# EAGLE design EVmulator_T85_Proto (EAGLE 9.6.2)
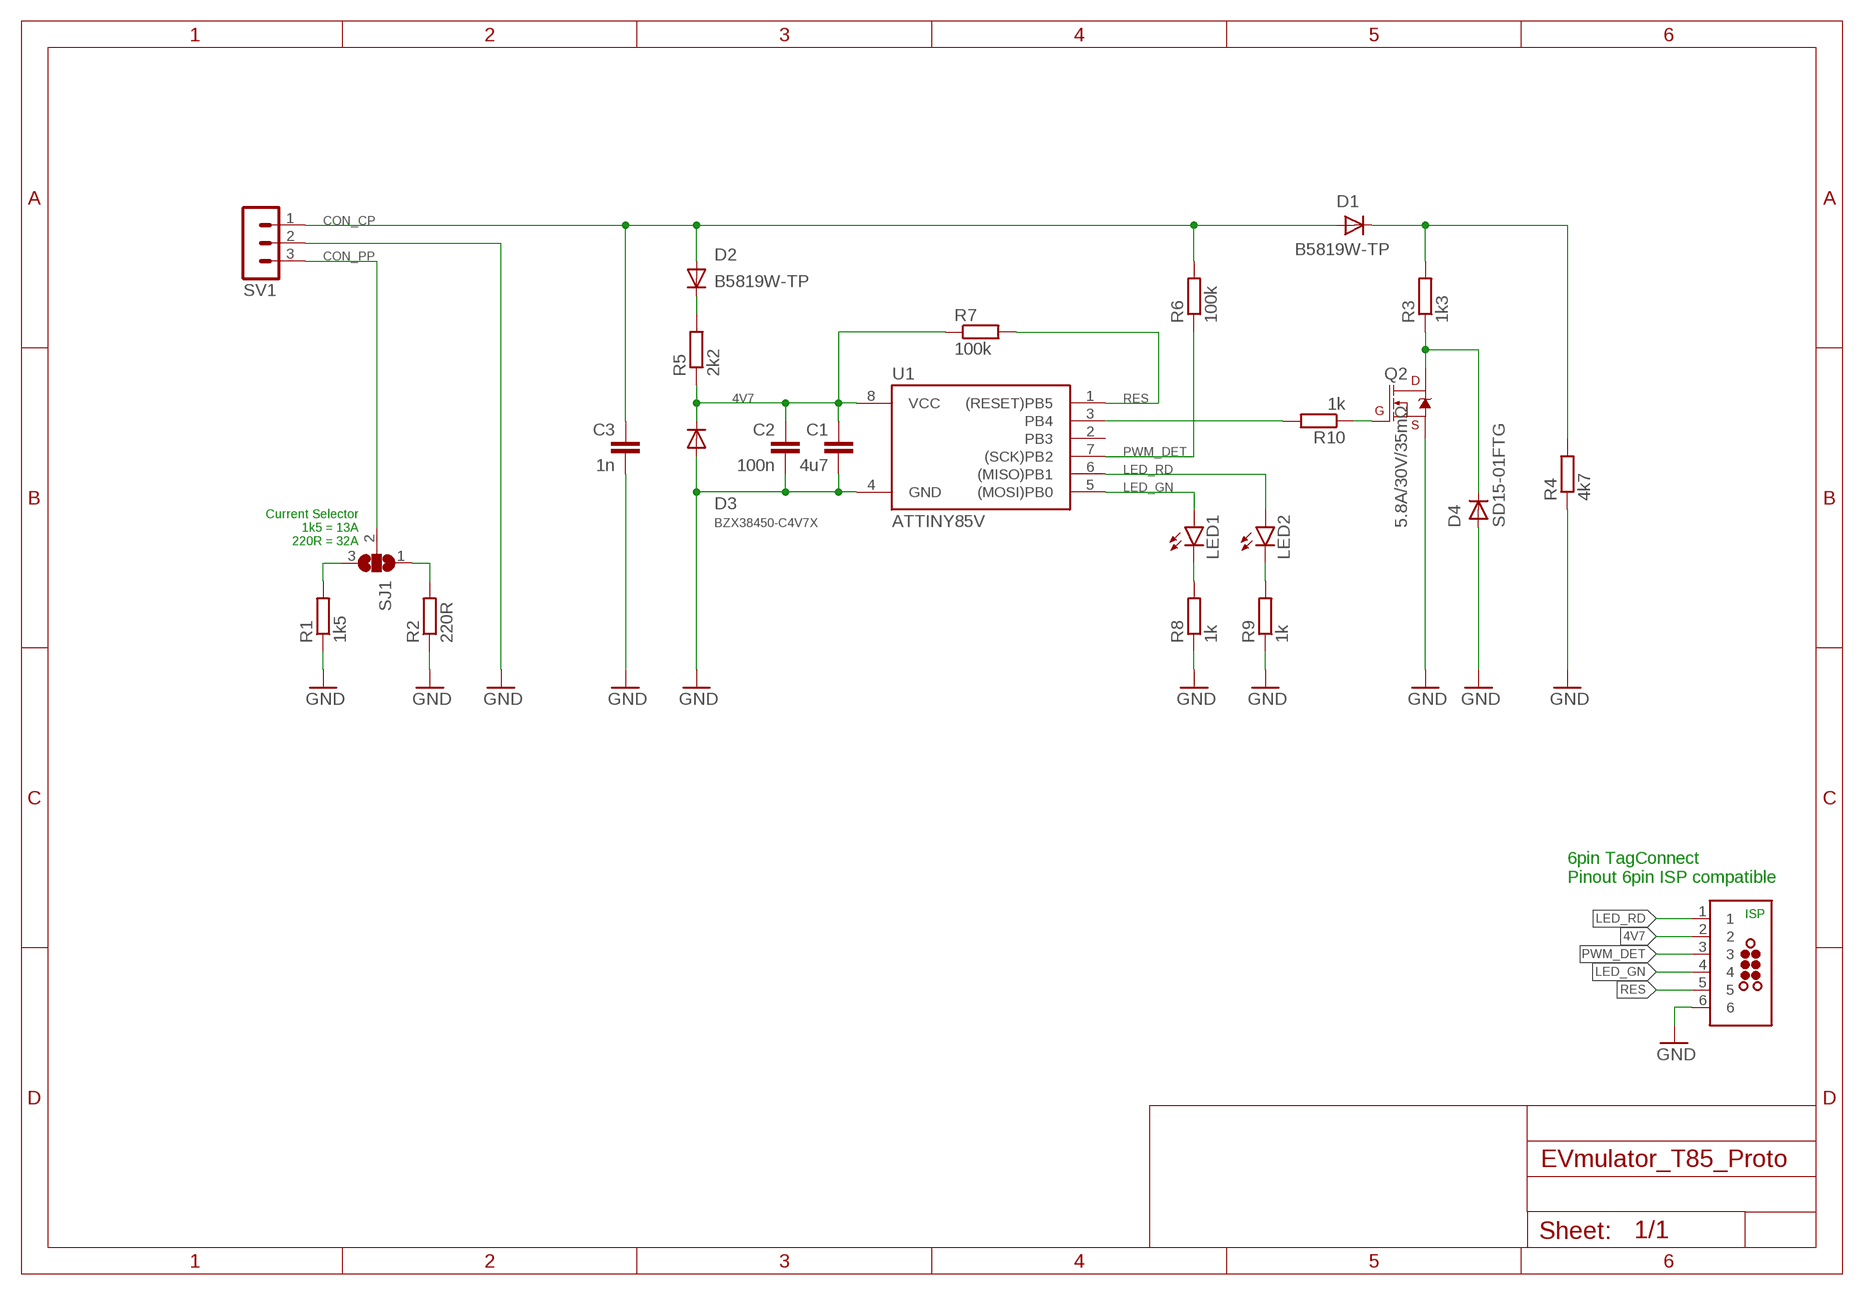
[diagram p0: schematic, sheet 1]

## Parts
C1  4u7  C-EUC0603  [C0603]
C2  100n  C-EUC0603  [C0603]
C3  1n  C-EUC0603  [C0603]
D1  B5819W-TP  DIODESOD-123  [SOD-123]
D2  B5819W-TP  DIODESOD-123  [SOD-123]
D3  BZX38450-C4V7X  DIODESOD-323F  [SOD-323F]
D4  SD15-01FTG  DIODESOD-323F  [SOD-323F]
J1  TAG-CONNECT_TC2030-MCP-NL  [TAG-CONNECT_TC2030-MCP-NL]
LED1  LEDCHIP-LED0603  [CHIP-LED0603]
LED2  LEDCHIP-LED0603  [CHIP-LED0603]
Q2  5.8A/30V/35mΩ  MOSFET-NCH-AO3404A  [SOT23-3]
R1  1k5  R-EU_R0805  [R0805]
R2  220R  R-EU_R0805  [R0805]
R3  1k3  R-EU_R0603  [R0603]
R4  4k7  R-EU_R0603  [R0603]
R5  2k2  R-EU_R0603  [R0603]
R6  100k  R-EU_R0603  [R0603]
R7  100k  R-EU_R0603  [R0603]
R8  1k  R-EU_R0603  [R0603]
R9  1k  R-EU_R0603  [R0603]
R10  1k  R-EU_R0603  [R0603]
SJ1  SJ2W  [SJ_2]
SV1  MA03-1  [MA03-1]
U1  ATTINY85V  ATTINY25/45/85-20SU  [SOIC8_200]

## Nets
4V7: C1.1 C2.1 D3.C J1.2 R5.1 R7.1 U1.8(VCC)
CON_CP: C3.1 D1.A D2.A R6.2 SV1.1
CON_PP: SJ1.2 SV1.3
GND: C1.2 C2.2 C3.2 D3.A D4.A J1.6 Q2.2(S) R1.1 R2.1 R4.1 R8.1 R9.1 SV1.2 U1.4(GND)
LED_GN: J1.4 LED1.A U1.5((MOSI)PB0)
LED_RD: J1.1 LED2.A U1.6((MISO)PB1)
N$1: R1.2 SJ1.3
N$2: R2.2 SJ1.1
N$3: LED1.C R8.2
N$4: LED2.C R9.2
N$5: D4.C Q2.3(D) R3.1
N$6: D1.C R3.2 R4.2
N$7: D2.C R5.2
N$8: Q2.1(G) R10.1
N$10: R10.2 U1.3(PB4)
PWM_DET: J1.3 R6.1 U1.7((SCK)PB2)
RES: J1.5 R7.2 U1.1((RESET)PB5)
Unconnected: U1.2(PB3)

## Notes on the sheet
- Current Selector
  1k5 = 13A
  220R = 32A
- 6pin TagConnect
  Pinout 6pin ISP compatible
- ISP

## Library data of the parts
C1-C3 = rcl:C-EU: CAPACITOR, European symbol; SPICEPREFIX: C
D1-D4 = adafruit:DIODE: Diode SMADIODE - SMA Surface Mount Package 20V 1A Schottky Diode Digikey: 641-1014-6-ND DO-1N4148 - Through Hole Small Current Diode SOD-123 20V 1 A (.5mV Vf) Schottky Diode - Digikey: MBRX120TPMSCT-ND SOD-323 10V 570mA (.38mV Vf, 3ns) Schottky Diode - Digikey: ZLLS410CT-ND SOD-523 30V 30mA Schottky Diode (RB751S-40TE61) - Digikey: RB751S-40TE61CT-ND SOT23-R/W - SOT23 Package (R = Solder Paste/Reflow Ovens, W = Hand-Soldering) BAT54Film 40V 300mA - Digikey: 497-7162-1-ND
J1 = Eigene-Rietig:TAG-CONNECT_TC2030: TAG-CONNECT ICSP Connector Manufacturer: Tag-Connect <http://www.tag-connect.com> Cable for easy In-Circuit Serial Programming. Designed for Microchip ICD2, suitable for many others. Two variants - one "with legs" (for hands-free fit on PCB) and another "without legs" for quick programming. PAD Description 1 MCLR/Vpp 2 Vdd 3 GND 4 PGD (ISPDAT) 5 PGC (ISPCLK) 6 nc (used for LVP) ©2009 ROFA.cz - modified and updated by Robert Darlington ‹rdarlington@gmail.com›
LED1 LED2 = led:LED: LED OSRAM: - CHIPLED LG R971, LG N971, LY N971, LG Q971, LY Q971, LO R971, LY R971 LH N974, LH R974 LS Q976, LO Q976, LY Q976 LO Q996 - Hyper CHIPLED LW Q18S LB Q993, LB Q99A, LB R99A - SideLED LS A670, LO A670, LY A670, LG A670, LP A670 LB A673, LV A673, LT A673, LW A673 LH A674 LY A675 LS A676, LA A676, LO A676, LY A676, LW A676 LS A679, LY A679, LG A679 - Hyper Micro SIDELED® LS Y876, LA Y876, LO Y876, LY Y876 LT Y87S - SmartLED LW L88C, LW L88S LB L89C, LB L89S, LG L890 LS L89K, LO L89K, LY L89K LS L896, LA L896, LO L896, LY L896 - TOPLED LS T670, LO T670, LY T670, LG T670, LP T670 LSG T670, LSP T670, LSY T670, LOP T670, LYG T670 LG T671, LOG T671, LSG T671 LB T673, LV T673, LT T673, LW T673 LH T674 LS T676, LA T676, LO T676, LY T676, LB T676, LH T676, LSB T676, LW T676 LB T67C, LV T67C, LT T67C, LS T67K, LO T67K, LY T67K, LW E67C LS E67B, LA E67B, LO E67B, LY E67B, LB E67C, LV E67C, LT E67C LW T67C LS T679, LY T679, LG T679 LS T770, LO T770, LY T770, LG T770, LP T770 LB T773, LV T773, LT T773, LW T773 LH T774 LS E675, LA E675, LY E675, LS T675 LS T776, LA T776, LO T776, LY T776, LB T776 LHGB T686 LT T68C, LB T68C - Hyper Mini TOPLED® LB M676 - Mini TOPLED Santana® LG M470 LS M47K, LO M47K, LY M47K Source: http://www.osram.convergy.de LUXEON: - LUMILED® LXK2-PW12-R00, LXK2-PW12-S00, LXK2-PW14-U00, LXK2-PW14-V00 LXK2-PM12-R00, LXK2-PM12-S00, LXK2-PM14-U00 LXK2-PE12-Q00, LXK2-PE12-R00, LXK2-PE12-S00, LXK2-PE14-T00, LXK2-PE14-U00 LXK2-PB12-K00, LXK2-PB12-L00, LXK2-PB12-M00, LXK2-PB14-N00, LXK2-PB14-P00, LXK2-PB14-Q00 LXK2-PR12-L00, LXK2-PR12-M00, LXK2-PR14-Q00, LXK2-PR14-R00 LXK2-PD12-Q00, LXK2-PD12-R00, LXK2-PD12-S00 LXK2-PH12-R00, LXK2-PH12-S00 LXK2-PL12-P00, LXK2-PL12-Q00, LXK2-PL12-R00 Source: www.luxeon.com KINGBRIGHT: KA-3528ASYC Source: www.kingbright.com
Q2 = SparkFun-DiscreteSemi:MOSFET-NCH: N-channel MOSFETs Voltage controlled devices that allow control of high current outputs. SparkFun Products: SparkFun OpenScale <https://www.sparkfun.com/products/13261> SparkFun Digital Sandbox <https://www.sparkfun.com/products/12651> SparkFun Monster Moto Shield <https://www.sparkfun.com/products/10182> SparkFun MOSFET Power Controller <https://www.sparkfun.com/products/11214>; PROD_ID: TRANS-12988
R1-R10 = rcl:R-EU_: RESISTOR, European symbol; SPICEPREFIX: R
SJ1 = jumper:SJ2W: SMD solder JUMPER
SV1 = con-lstb:MA03-1: PIN HEADER; OC_FARNELL: unknown; OC_NEWARK: unknown
U1 = Eigene-Rietig:ATTINY25/45/85

## Board
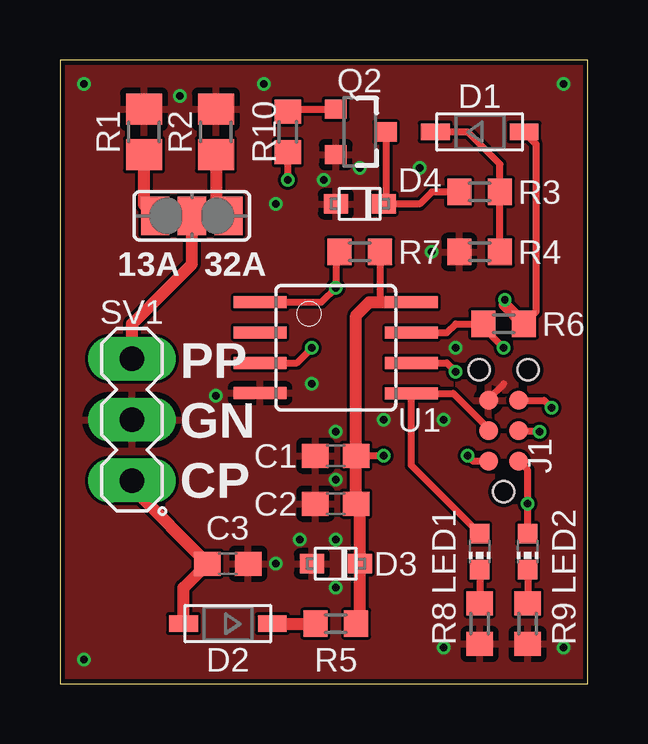
[diagram p1: board, top side]
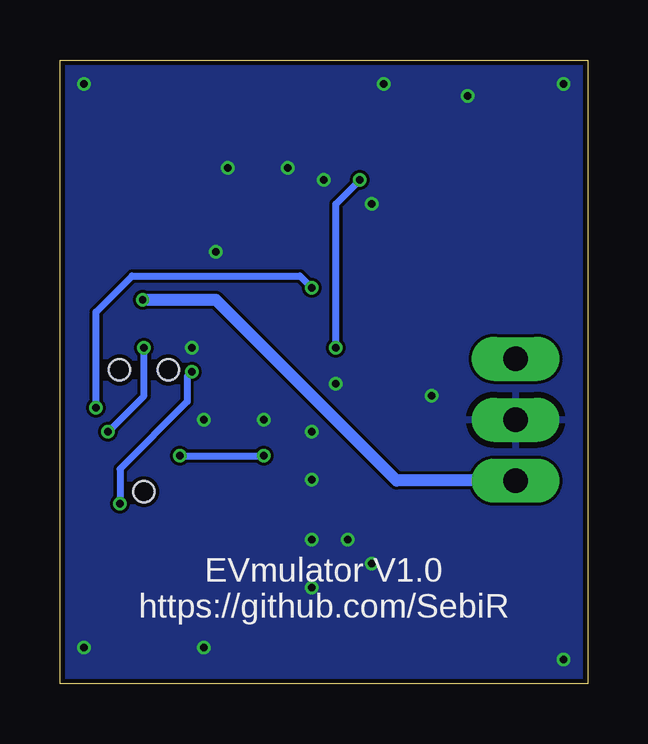
[diagram p2: board, bottom side, seen from below]

Size 22 x 26 mm. Coordinates in mm from the lower left corner, seen from the top.
Outline: 0,0 22,0 22,26 0,26 0,0
Copper layers (1*16): Top 0.035mm / dielectric 1.6mm / Bottom 0.035mm
Design rules "jlcpcb-2layers": minimum track width 0.2mm, minimum drill 0.3mm, track to track 5mil, track to pad 5mil, pad to pad 5mil, via to via 5mil, smd to smd 5mil, copper to edge 0.2mm, drill to drill 6mil, minimum pad ring 10mil, minimum via ring 0.125mm, stop-mask expansion 4mil, vias tented up to drill 0.5mm, thermal gap 10mil

### Footprints (pad centres in the part's own frame; a part is rotated, then mirrored left to right if it is on the bottom)
C0603 = smd 1.1 x 1: 1 -0.85,0; 2 0.85,0
SOD-123 = smd 1.2 x 0.7: A 1.85,0; C -1.85,0
SOD-323F = smd 1 x 0.8: A -1,0; C 1,0
TAG-CONNECT_TC2030-MCP-NL = smd 0.787 x 0.787: 1 1.27,-0.635; 2 1.27,0.635; 3 2.54,-0.635; 4 2.54,0.635; 5 3.81,-0.635; 6 3.81,0.635 | hole 0.889: 0,0; 5.08,-1.016; 5.08,1.016
CHIP-LED0603 = smd 0.8 x 0.8: A 0,-0.75; C 0,0.75
SOT23-3 = smd 0.8 x 0.9: 1 -0.95,-1; 2 0.95,-1; 3 0,1.1
R0805 = smd 1.3 x 1.5: 1 -0.95,0; 2 0.95,0
R0603 = smd 1 x 1.1: 1 -0.85,0; 2 0.85,0
SJ_2 = smd 1.168 x 1.6: 1 -1.524,0; 2 0,0; 3 1.524,0
MA03-1 = drill 1.016 long: 1 -2.54,0; 2 0,0; 3 2.54,0
SOIC8_200 = smd 0.5 x 2.2: 1 -1.905,-3.154; 2 -0.645,-3.154; 3 0.625,-3.154; 4 1.895,-3.154; 5 1.905,3.154; 6 0.635,3.154; 7 -0.635,3.154; 8 -1.905,3.154

### Placement (x,y rotation side)
C1  11.5,9.5 180 top
C2  11.5,7.5 180 top
C3  7,5 0 top
D1  17.5,23 0 top
D2  7,2.5 180 top
D3  11.5,5 0 top
D4  12.5,20 0 top
J1  18.5,8 90 top
LED1  17.5,5.5 180 top
LED2  19.5,5.5 180 top
Q2  12.5,23 270 top
R1  3.5,23 270 top
R2  6.5,23 270 top
R3  17.5,20.5 0 top
R4  17.5,18 0 top
R5  11.5,2.5 180 top
R6  18.5,15 0 top
R7  12.5,18 180 top
R8  17.5,2.5 90 top
R9  19.5,2.5 90 top
R10  9.5,23 270 top
SJ1  5.5,19.5 180 top
SV1  3,11 90 top
U1  11.5,14 270 top

### Tracks (layer width: path | path; a pad name or v marks a point on that pad's centre or on a via)
4V7  (via drill 0.3)
  Top 0.3: R7.1 13.35,15.9 | J1.2 17.23,9.27 v17,9.5 | v13.5,9.5 C1.1
  Top 0.5: R5.1 12.5,2.65 D3.C 12.5,7.35 C2.1 C1.1 12.35,15.35 12.9,15.9 13.35,15.9 U1.8
  Bottom 0.3: v17,9.5 v13.5,9.5
CON_CP  (via drill 0.3)
  Top 0.3: D1.A 19.85,22.5 19.85,15.5 R6.2
  Top 0.5: D2.A 5.15,4 C3.1 3,8.15 SV1.1 | v18.55,16 18.55,15.8 R6.2
  Bottom 0.5: SV1.1 7.96,8.46 15.5,16 v18.55,16
CON_PP
  Top 0.5: SV1.3 3,15 5.5,17.5 SJ1.2
GND  (via drill 0.3)
  Top 0.3: J1.6 17.86,11.87 18.5,12.5
  other vias: 16,1.5 21,1.5 9,5 11.5,4 11.5,6 10,6 11.5,10.5 11.5,8.5 10.5,12.5 6.5,12 9,20 11,21 8.5,25 5,24.5 1,25 21,25 1,1 16,11 16.5,14 13.5,11 15.5,18 15,21.5 12.5,21.5
  pour Top: 0,26 22,26 22,0 0,0
  pour Bottom: 0,26 22,26 22,0 0,0
LED_GN
  Top 0.3: LED1.A 14.65,9.1 U1.5 16.41,12.1 17.86,10.63 J1.4
LED_RD  (via drill 0.3)
  Top 0.3: LED2.A v19.5,7.5 19.5,8.9 J1.1 | U1.6 16.14,13.37 v16.5,13
  Bottom 0.3: v16.5,13 16.69,12.81 16.69,11.75 19.5,8.94 v19.5,7.5
N$1
  Top 0.5: SJ1.3 3.5,19.98 R1.2
N$2
  Top 0.5: R2.2 6.5,20.02 SJ1.1
N$3
  Top 0.3: LED1.C R8.2
N$4
  Top 0.3: LED2.C R9.2
N$5
  Top 0.3: R3.1 15.5,20.5 15,20 D4.C 13.6,20.1 Q2.3
N$6
  Top 0.3: R4.2 R3.2 18.35,21.65 17,23 D1.C
N$7
  Top 0.5: D2.C R5.2
N$8
  Top 0.3: 9.6,23.95 R10.1 9.6,23.95 | 9.6,23.95 Q2.1
N$10  (via drill 0.3)
  Top 0.3: U1.3 9.88,13.38 v10.5,14 | v9.5,21 R10.2
  Bottom 0.3: v10.5,14 10.5,20 v9.5,21
PWM_DET  (via drill 0.3)
  Top 0.3: U1.7 16.14,14.63 16.5,15 R6.1 17.65,14.85 v18.5,14 | J1.3 19.96,10.54 v20,10.5
  Bottom 0.3: v20,10.5 18.5,12 v18.5,14
RES  (via drill 0.3)
  Top 0.3: J1.5 20.19,11.81 v20.5,11.5 | R7.2 11.5,17.85 v11.5,16.5 10.9,15.9 U1.1
  Bottom 0.3: v20.5,11.5 20.5,15.5 19,17 12,17 v11.5,16.5

### Text on the board
bPlace: EVmulator V1.0 / https://github.com/SebiR
tNames: 13A | 32A | PP | GN | CP